# EAGLE design main_unit (EAGLE 7.1.0)
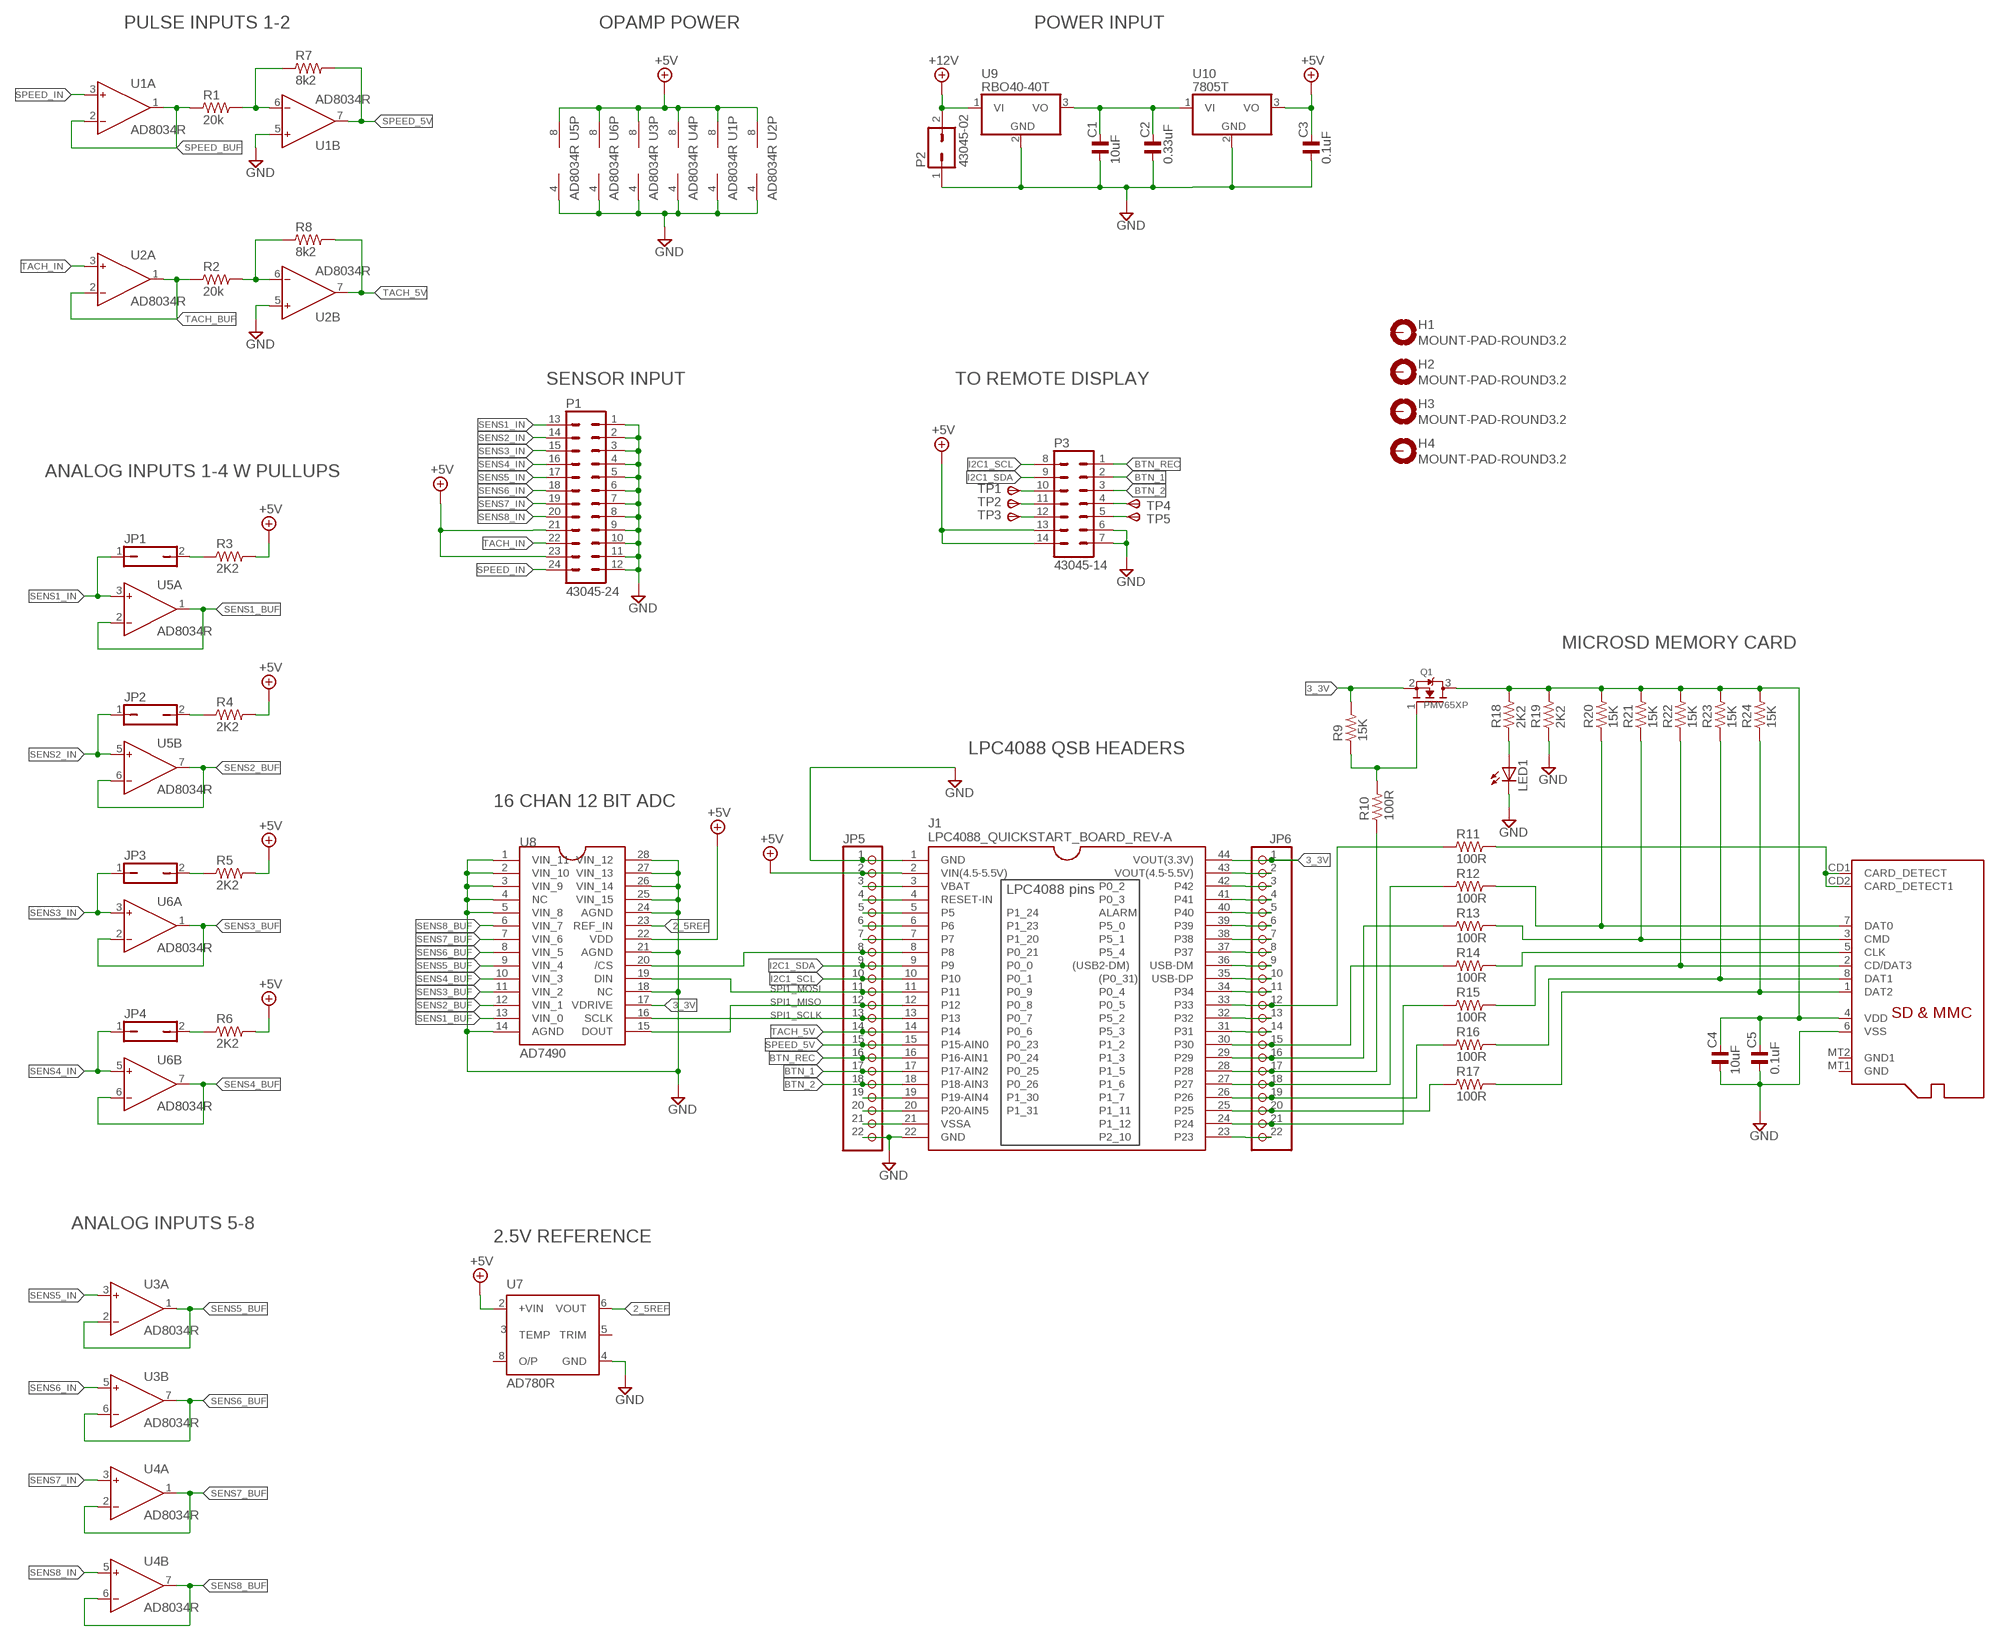
[diagram p0: schematic, sheet 1]

## Parts
C1  10uF  C_0805  [C0805]
C2  0.33uF  C_0805  [C0805]
C3  0.1uF  C_0805  [C0805]
C4  10uF  C_0805  [C0805]
C5  0.1uF  C_0805  [C0805]
H1  MOUNT-PAD-ROUND3.2  [3,2-PAD]
H2  MOUNT-PAD-ROUND3.2  [3,2-PAD]
H3  MOUNT-PAD-ROUND3.2  [3,2-PAD]
H4  MOUNT-PAD-ROUND3.2  [3,2-PAD]
J1  LPC4088_QUICKSTART_BOARD_REV-A  [LPC4088_QUICKSTART_BOARD_REV-A]
JP1  JP1Q  [JP1]
JP2  JP1Q  [JP1]
JP3  JP1Q  [JP1]
JP4  JP1Q  [JP1]
JP5  PINHD-1X22  [1X22]
JP6  PINHD-1X22  [1X22]
LED1  LEDCHIP-LED0805  [CHIP-LED0805]
P1  43045-24  [43045-24]
P2  43045-02  [43045-02]
P3  43045-14  [43045-14]
Q1  PMV65XP  MOSFET-NREFLOW  [SOT23]
R1  20k  R_0805  [R0805]
R2  20k  R_0805  [R0805]
R3  2K2  R_0805  [R0805]
R4  2K2  R_0805  [R0805]
R5  2K2  R_0805  [R0805]
R6  2K2  R_0805  [R0805]
R7  8k2  R_0805  [R0805]
R8  8k2  R_0805  [R0805]
R9  15K  R_0805  [R0805]
R10  100R  R_0805  [R0805]
R11  100R  R_0805  [R0805]
R12  100R  R_0805  [R0805]
R13  100R  R_0805  [R0805]
R14  100R  R_0805  [R0805]
R15  100R  R_0805  [R0805]
R16  100R  R_0805  [R0805]
R17  100R  R_0805  [R0805]
R18  2K2  R_0805  [R0805]
R19  2K2  R_0805  [R0805]
R20  15K  R_0805  [R0805]
R21  15K  R_0805  [R0805]
R22  15K  R_0805  [R0805]
R23  15K  R_0805  [R0805]
R24  15K  R_0805  [R0805]
SD1  MICROSD_SDMODE  [MICROSD]
TP1  TPSPAD1-13  [P1-13]
TP2  TPSPAD1-13  [P1-13]
TP3  TPSPAD1-13  [P1-13]
TP4  TPSPAD1-13  [P1-13]
TP5  TPSPAD1-13  [P1-13]
U1  AD8034R  [SO8]
U2  AD8034R  [SO8]
U3  AD8034R  [SO8]
U4  AD8034R  [SO8]
U5  AD8034R  [SO8]
U6  AD8034R  [SO8]
U7  AD780R  [SO8]
U8  AD7490  [TSSOP28]
U9  RBO40-40T  [TO220H]
U10  7805T  [TO220H]

## Nets
2_5REF: U7.6(VOUT) U8.23(REF_IN)
3_3V: J1.44(VOUT(3.3V)) JP6.1 Q1.2(S) R9.2 U8.17(VDRIVE)
+5V: C3.2 J1.2(VIN(4.5-5.5V)) JP5.2 P1.21 P1.23 P3.13 P3.14 R3.2 R4.2 R5.2 R6.2 U1.8(P:V+) U2.8(P:V+) U3.8(P:V+) U4.8(P:V+) U5.8(P:V+) U6.8(P:V+) U7.2(+VIN) U8.22(VDD) U10.3(VO)
+12V: P2.2 U9.1(VI)
BTN_1: J1.17(P17-AIN2) JP5.17 P3.2
BTN_2: J1.18(P18-AIN3) JP5.18 P3.3
BTN_REC: J1.16(P16-AIN1) JP5.16 P3.1
GND: C1.1 C2.1 C3.1 C4.1 C5.1 J1.1(GND) J1.22(GND) JP5.1 JP5.22 LED1.C P1.1 P1.2 P1.3 P1.4 P1.5 P1.6 P1.7 P1.8 P1.9 P1.10 P1.11 P1.12 P2.1 P3.6 P3.7 R19.1 SD1.6(VSS) U1.4(P:V-) U1.5(B:IN+) U2.4(P:V-) U2.5(B:IN+) U3.4(P:V-) U4.4(P:V-) U5.4(P:V-) U6.4(P:V-) U7.4(GND) U8.1(VIN_11) U8.2(VIN_10) U8.3(VIN_9) U8.4(NC) U8.5(VIN_8) U8.14(AGND) U8.18(NC) U8.21(AGND) U8.24(AGND) U8.25(VIN_15) U8.26(VIN_14) U8.27(VIN_13) U8.28(VIN_12) U9.2(GND) U10.2(GND)
I2C1_SCL: J1.10 JP5.10 P3.8
I2C1_SDA: J1.9 JP5.9 P3.9
N$1: R1.2 R7.1 U1.6(B:IN-)
N$2: R12.2 R20.1 SD1.7(DAT0)
N$3: R2.2 R8.1 U2.6(B:IN-)
N$4: R13.2 R21.1 SD1.3(CMD)
N$5: R14.2 SD1.5(CLK)
N$6: J1.8 JP5.8 U8.20(/CS)
N$7: R15.2 R22.1 SD1.2(CD/DAT3)
N$8: R16.2 R23.1 SD1.8(DAT1)
N$9: R17.2 R24.1 SD1.1(DAT2)
N$10: JP1.2 R3.1
N$11: J1.27 JP6.18 R12.1
N$12: J1.29 JP6.16 R13.1
N$13: J1.30 JP6.15 R14.1
N$14: J1.26 JP6.19 R16.1
N$15: J1.25 JP6.20 R17.1
N$16: J1.24 JP6.21 R15.1
N$17: J1.28 JP6.17 R10.1
N$18: Q1.1(G) R9.1 R10.2
N$19: LED1.A R18.1
N$20: R11.2 SD1.CD1(CARD_DETECT) SD1.CD2(CARD_DETECT1)
N$22: JP3.2 R5.1
N$23: J1.38 JP6.7
N$24: P3.10 TP1.TP(PP)
N$25: P3.11 TP2.TP(PP)
N$26: JP2.2 R4.1
N$27: C1.2 C2.2 U9.3(VO) U10.1(VI)
N$28: P3.12 TP3.TP(PP)
N$30: J1.3(VBAT) JP5.3
N$31: JP4.2 R6.1
N$32: J1.4(RESET-IN) JP5.4
N$33: P3.4 TP4.TP(PP)
N$34: J1.5 JP5.5
N$35: J1.6 JP5.6
N$36: P3.5 TP5.TP(PP)
N$37: J1.7 JP5.7
N$38: J1.19(P19-AIN4) JP5.19
N$39: J1.20(P20-AIN5) JP5.20
N$40: J1.21(VSSA) JP5.21
N$41: J1.43(VOUT(4.5-5.5V)) JP6.2
N$42: J1.42 JP6.3
N$43: J1.41 JP6.4
N$44: J1.40 JP6.5
N$45: J1.39 JP6.6
N$46: J1.37 JP6.8
N$47: J1.36(USB-DM) JP6.9
N$48: J1.35(USB-DP) JP6.10
N$49: J1.34 JP6.11
N$50: J1.33 JP6.12 R11.1
N$51: J1.32 JP6.13
N$52: J1.31 JP6.14
N$53: J1.23 JP6.22
SENS1_BUF: U5.1(A:OUT) U5.2(A:IN-) U8.13(VIN_0)
SENS1_IN: JP1.1 P1.13 U5.3(A:IN+)
SENS2_BUF: U5.6(B:IN-) U5.7(B:OUT) U8.12(VIN_1)
SENS2_IN: JP2.1 P1.14 U5.5(B:IN+)
SENS3_BUF: U6.1(A:OUT) U6.2(A:IN-) U8.11(VIN_2)
SENS3_IN: JP3.1 P1.15 U6.3(A:IN+)
SENS4_BUF: U6.6(B:IN-) U6.7(B:OUT) U8.10(VIN_3)
SENS4_IN: JP4.1 P1.16 U6.5(B:IN+)
SENS5_BUF: U3.1(A:OUT) U3.2(A:IN-) U8.9(VIN_4)
SENS5_IN: P1.17 U3.3(A:IN+)
SENS6_BUF: U3.6(B:IN-) U3.7(B:OUT) U8.8(VIN_5)
SENS6_IN: P1.18 U3.5(B:IN+)
SENS7_BUF: U4.1(A:OUT) U4.2(A:IN-) U8.7(VIN_6)
SENS7_IN: P1.19 U4.3(A:IN+)
SENS8_BUF: U4.6(B:IN-) U4.7(B:OUT) U8.6(VIN_7)
SENS8_IN: P1.20 U4.5(B:IN+)
SPEED_5V: J1.15(P15-AIN0) JP5.15 R7.2 U1.7(B:OUT)
SPEED_BUF: R1.1 U1.1(A:OUT) U1.2(A:IN-)
SPEED_IN: P1.24 U1.3(A:IN+)
SPI1_MISO: J1.12 JP5.12 U8.15(DOUT)
SPI1_MOSI: J1.11 JP5.11 U8.19(DIN)
SPI1_SCLK: J1.13 JP5.13 U8.16(SCLK)
TACH_5V: J1.14 JP5.14 R8.2 U2.7(B:OUT)
TACH_BUF: R2.1 U2.1(A:OUT) U2.2(A:IN-)
TACH_IN: P1.22 U2.3(A:IN+)
VDD: C4.2 C5.2 Q1.3(D) R18.2 R19.2 R20.2 R21.2 R22.2 R23.2 R24.2 SD1.4(VDD)
Unconnected: H1.B3,2(MOUNT) H2.B3,2(MOUNT) H3.B3,2(MOUNT) H4.B3,2(MOUNT) SD1.MT1(GND) SD1.MT2(GND1) U7.3(TEMP) U7.5(TRIM) U7.8(O/P)

## Notes on the sheet
- PULSE INPUTS 1-2 | OPAMP POWER | POWER INPUT
- SENSOR INPUT | TO REMOTE DISPLAY
- ANALOG INPUTS 1-4 W PULLUPS
- MICROSD MEMORY CARD
- LPC4088 QSB HEADERS
- 16 CHAN 12 BIT ADC
- ANALOG INPUTS 5-8
- 2.5V REFERENCE

## Library data of the parts
C1-C5 = rc-master-smd:C_: NON-POLARIZED CAP
H1-H4 = holes:MOUNT-PAD-ROUND: MOUNTING PAD, round
J1 = lpc4088_quickstart_board:LPC4088_QUICKSTART_BOARD_REV-A
JP1-JP4 = jumper:JP1Q: JUMPER
JP5 JP6 = pinhead:PINHD-1X22: PIN HEADER
LED1 = adafruit:LED: LED OSRAM: - CHIPLED LG R971, LG N971, LY N971, LG Q971, LY Q971, LO R971, LY R971 LH N974, LH R974 LS Q976, LO Q976, LY Q976 LO Q996 - Hyper CHIPLED LW Q18S LB Q993, LB Q99A, LB R99A - SideLED LS A670, LO A670, LY A670, LG A670, LP A670 LB A673, LV A673, LT A673, LW A673 LH A674 LY A675 LS A676, LA A676, LO A676, LY A676, LW A676 LS A679, LY A679, LG A679 - Hyper Micro SIDELED® LS Y876, LA Y876, LO Y876, LY Y876 LT Y87S - SmartLED LW L88C, LW L88S LB L89C, LB L89S, LG L890 LS L89K, LO L89K, LY L89K LS L896, LA L896, LO L896, LY L896 - TOPLED LS T670, LO T670, LY T670, LG T670, LP T670 LSG T670, LSP T670, LSY T670, LOP T670, LYG T670 LG T671, LOG T671, LSG T671 LB T673, LV T673, LT T673, LW T673 LH T674 LS T676, LA T676, LO T676, LY T676, LB T676, LH T676, LSB T676, LW T676 LB T67C, LV T67C, LT T67C, LS T67K, LO T67K, LY T67K, LW E67C LS E67B, LA E67B, LO E67B, LY E67B, LB E67C, LV E67C, LT E67C LW T67C LS T679, LY T679, LG T679 LS T770, LO T770, LY T770, LG T770, LP T770 LB T773, LV T773, LT T773, LW T773 LH T774 LS E675, LA E675, LY E675, LS T675 LS T776, LA T776, LO T776, LY T776, LB T776 LHGB T686 LT T68C, LB T68C - Hyper Mini TOPLED® LB M676 - Mini TOPLED Santana® LG M470 LS M47K, LO M47K, LY M47K Source: http://www.osram.convergy.de/
P1 = con-molex-micro-fit:43045-24: HEADER
P2 = con-molex-micro-fit:43045-02: HEADER
P3 = con-molex-micro-fit:43045-14: HEADER
Q1 = adafruit:MOSFET-N: N-Channel Mosfet 2N7002E - 60V 260mA SOT23 [Digikey: 2N7002ET1GOSTR-ND] - REEL BSH103 - 30V 850mA SOT23 [Digikey: 568-5013-1-ND]
R1-R24 = rc-master-smd:R_: RESISTOR
SD1 = adafruit:MICROSD_SDMODE: modified for SDMODE by Dan D.
TP1-TP5 = testpad:TPS: TEST PIN; OC_NEWARK: unknown
U1-U6 = analog-devices:AD8034: 2.7 V, 800 ?A, 80 MHz Rail-to-Rail I/O Amplifiers Source: http://www.analog.com/static/imported-files/data_sheets/AD8031_8032.pdf; MF: ALTERA CORPORATION; MPN: AD8033ARZ; OC_FARNELL: 8621519; OC_NEWARK: 59K6245
U7 = analog-devices:AD780: High Precision Reference 2.5V/3.0V Source: http://www.analog.com/UploadedFiles/Data_Sheets/AD780.pdf; MPN: AD780BRZ-REEL; OC_FARNELL: 1464655; OC_NEWARK: 12M8938
U8 = analog-devices:AD7490: AD7490 by Dan D.
U9 = dan:RBO40-40T
U10 = adafruit:78*: Positive VOLTAGE REGULATOR Added bigger pads to the TO-92 package

## Board
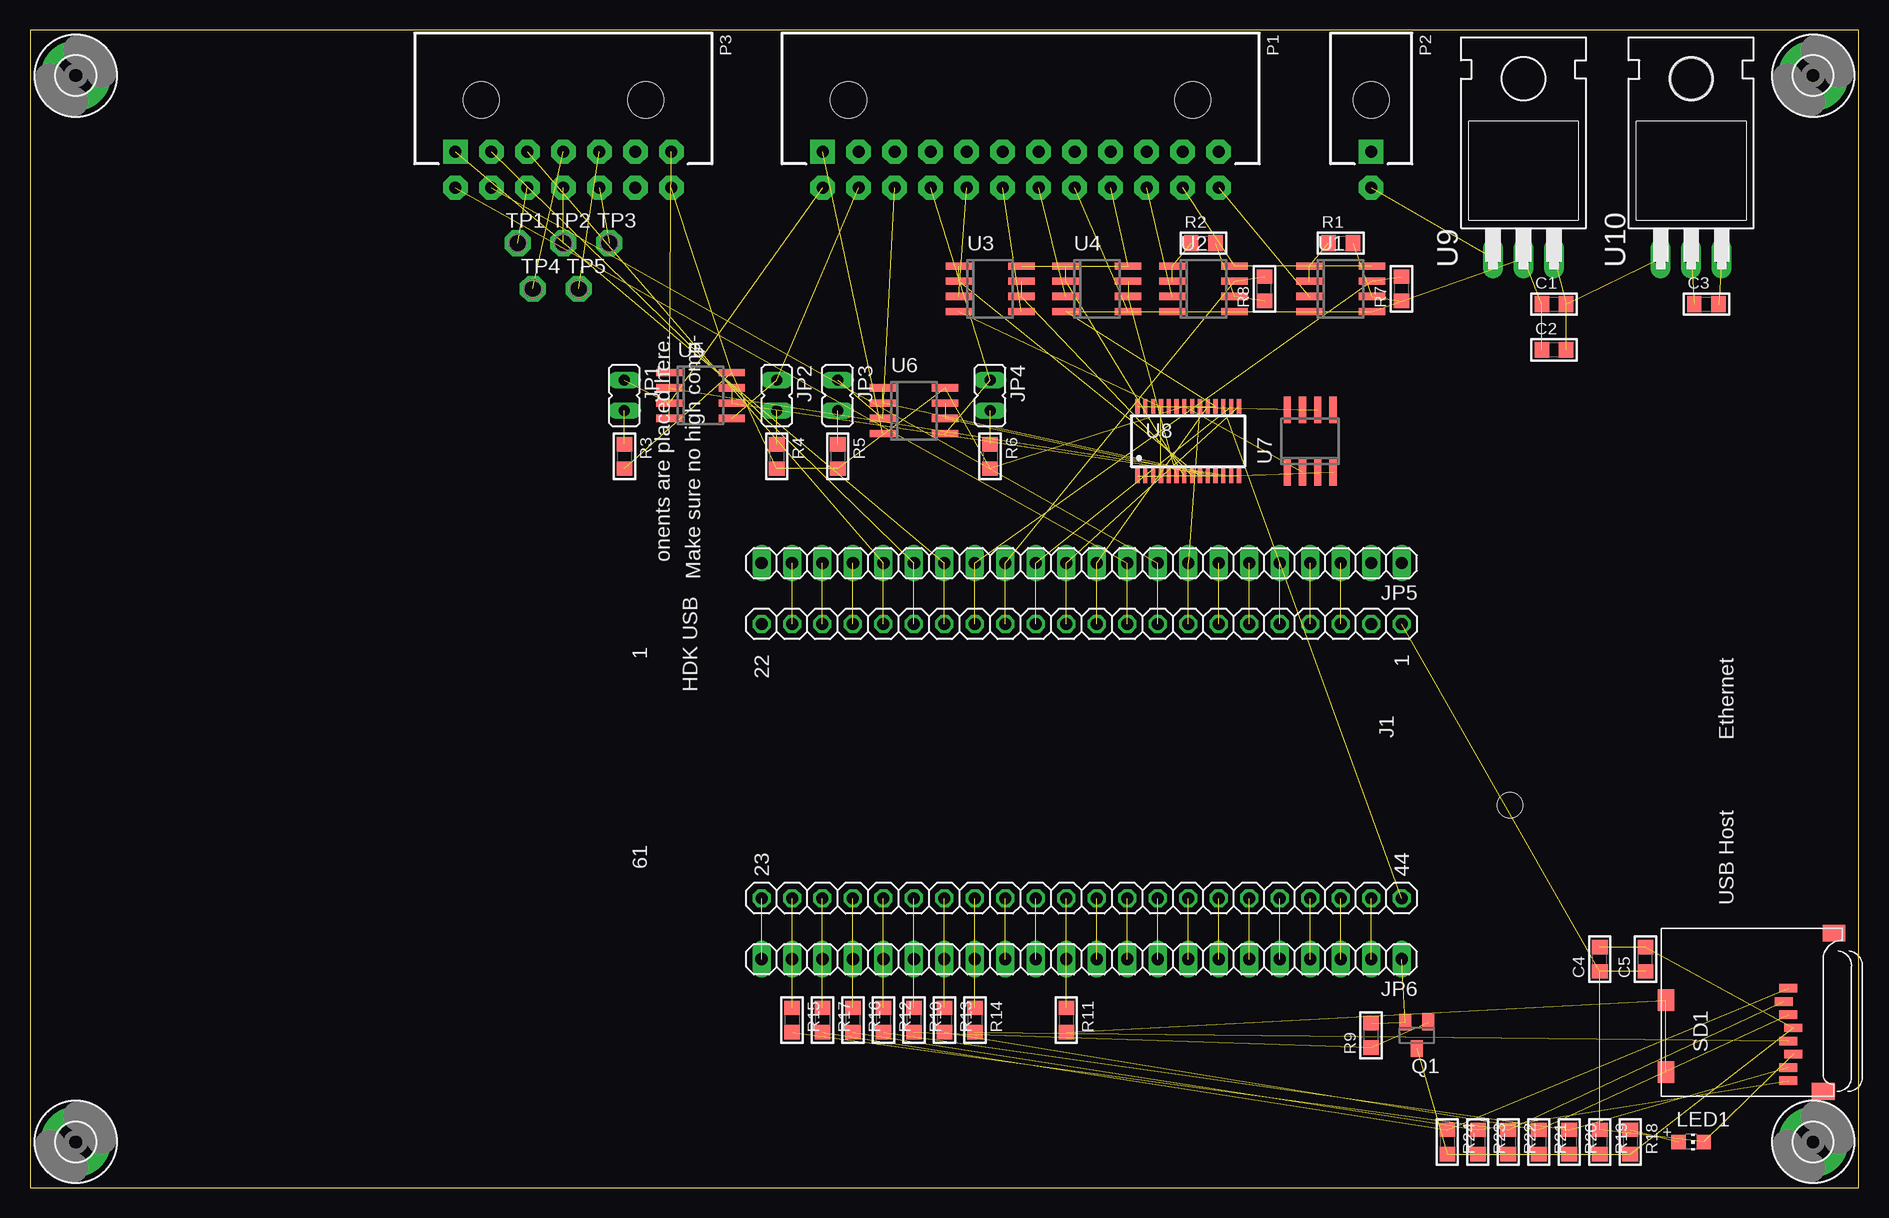
[diagram p1: board, top side]
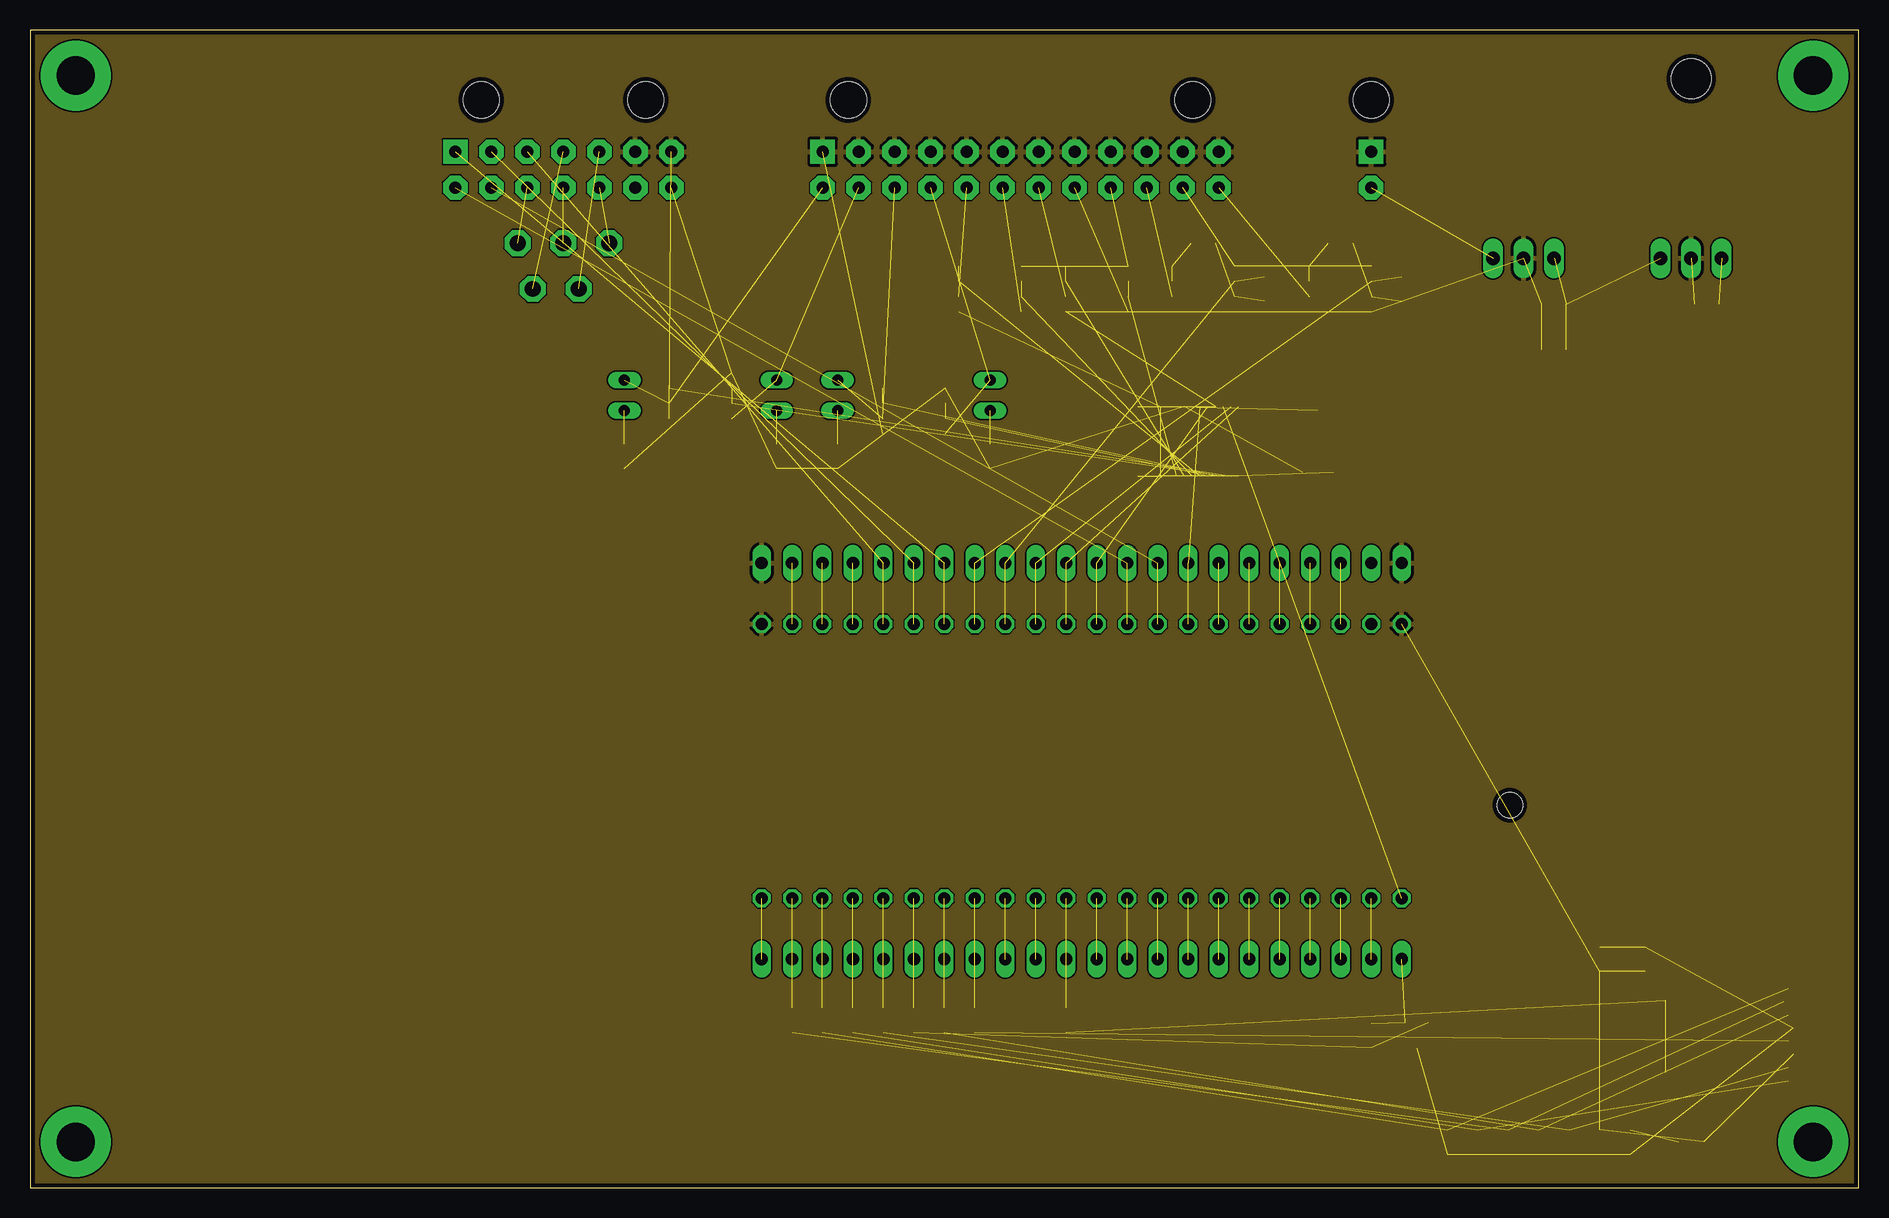
[diagram p2: board, inner layer GroundPlane]
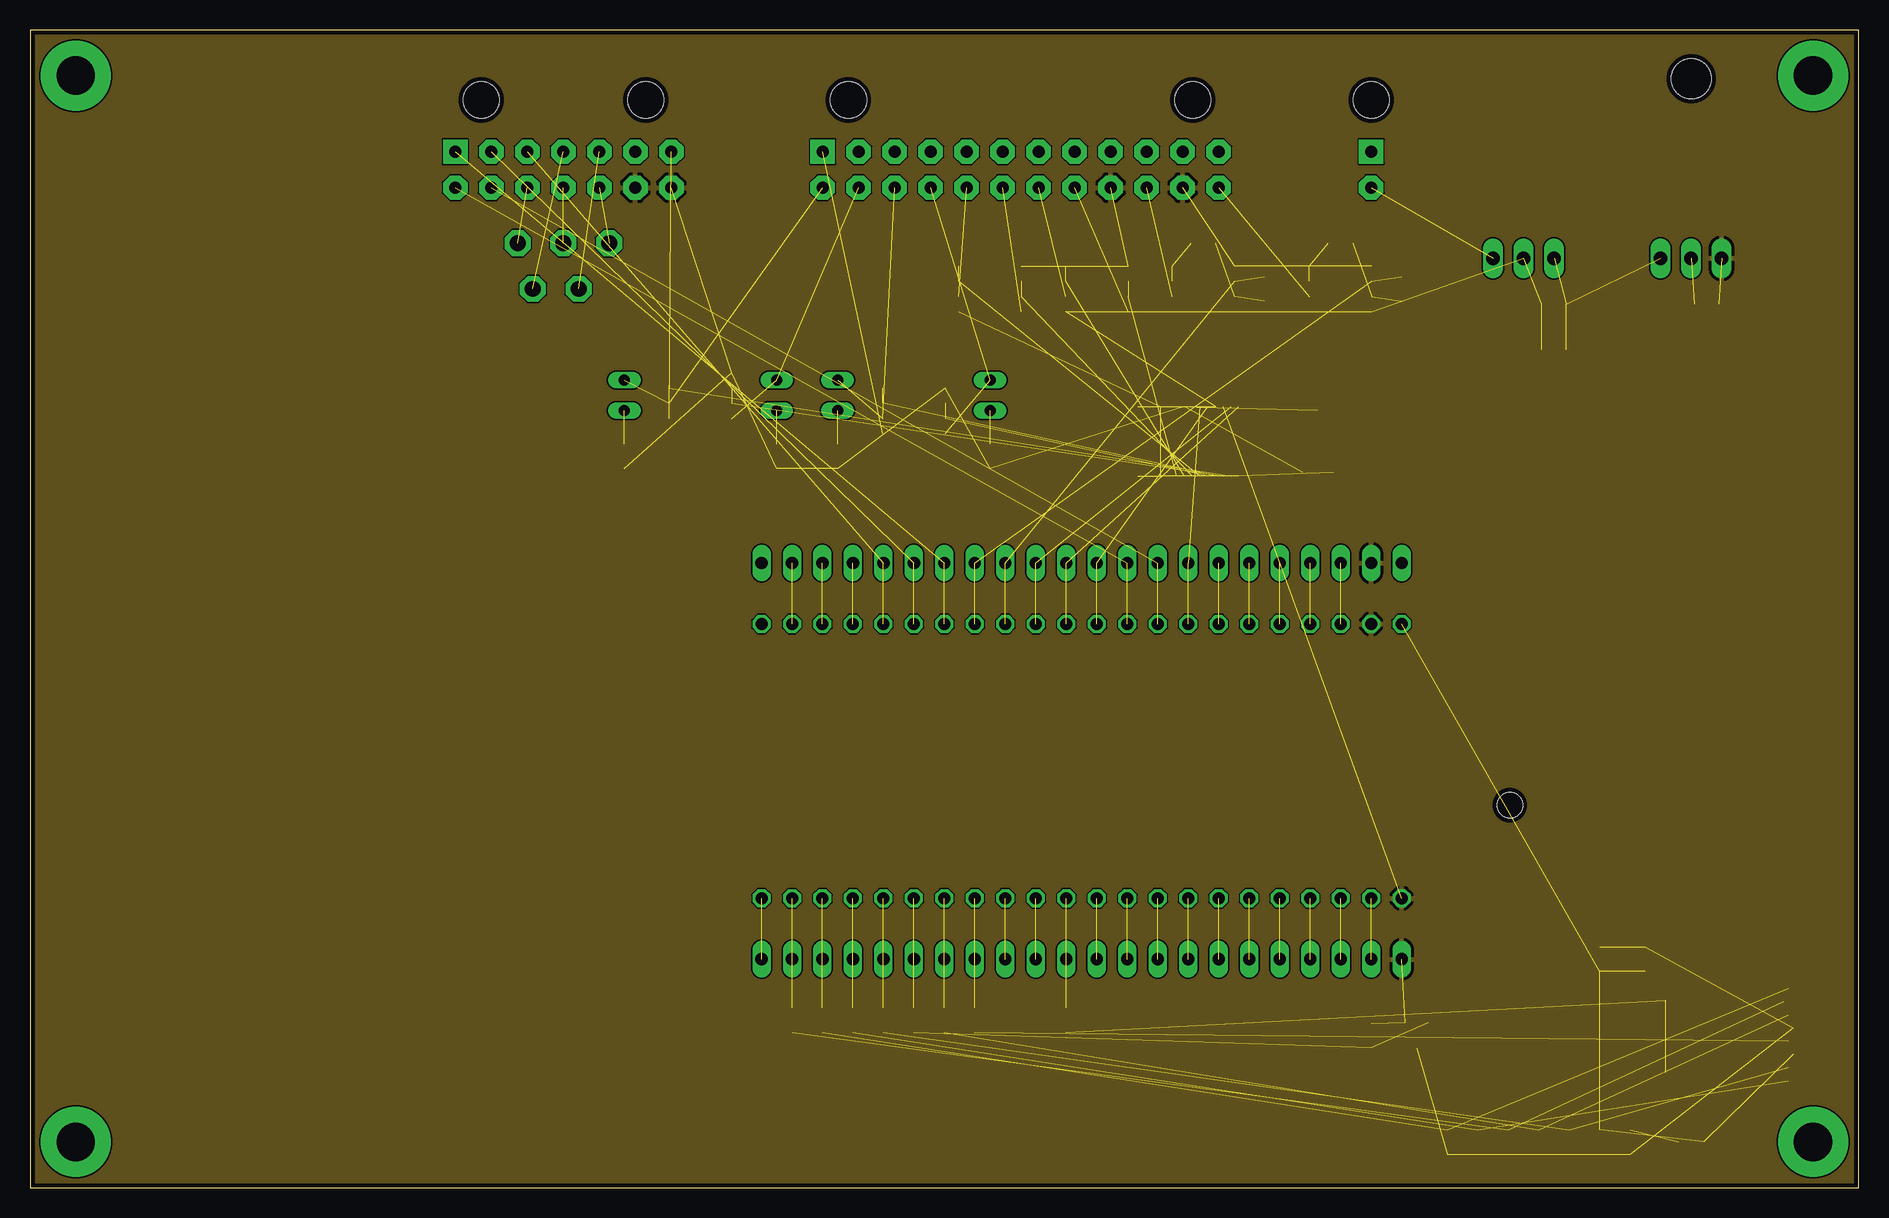
[diagram p3: board, inner layer PowerPlane]

Size 152.4 x 96.51 mm. Coordinates in mm from the lower left corner, seen from the top.
Outline: 0,0 152.4,0 152.4,96.51 0,96.51 0,0
Copper layers (1*2*15*16): Top 0.035559375mm / dielectric 0.17018125mm / GroundPlane 0.01778125mm / dielectric 47mil / PowerPlane 0.01778125mm / dielectric 0.17018125mm / Bottom 0.035559375mm
Design rules "OSHPark-4layer *": minimum track width 7mil, minimum drill 10mil, track to track 5mil, track to pad 5mil, pad to pad 5mil, via to via 5mil, smd to smd 5mil, copper to edge 15mil, drill to drill 6mil, minimum pad ring 4mil, minimum via ring 4mil, stop-mask expansion 4mil, vias tented up to drill 0mil, thermal gap 10mil

### Footprints (pad centres in the part's own frame; a part is rotated, then mirrored left to right if it is on the bottom)
C0805 = smd 1.2 x 1.3: 1 -1.016,0; 2 1.016,0
3,2-PAD = drill 3.2 pad 5.842: B3,2 0,0
LPC4088_QUICKSTART_BOARD_REV-A = drill 1 octagon: 1 -11.43,24.13; 2 -11.43,21.59; 3 -11.43,19.05; 4 -11.43,16.51; 5 -11.43,13.97; 6 -11.43,11.43; 7 -11.43,8.89; 8 -11.43,6.35; 9 -11.43,3.81; 10 -11.43,1.27; 11 -11.43,-1.27; 12 -11.43,-3.81; 13 -11.43,-6.35; 14 -11.43,-8.89; 15 -11.43,-11.43; 16 -11.43,-13.97; 17 -11.43,-16.51; 18 -11.43,-19.05; 19 -11.43,-21.59; 20 -11.43,-24.13; 21 -11.43,-26.67; 22 -11.43,-29.21; 23 11.43,-29.21; 24 11.43,-26.67; 25 11.43,-24.13; 26 11.43,-21.59; 27 11.43,-19.05; 28 11.43,-16.51; 29 11.43,-13.97; 30 11.43,-11.43; 31 11.43,-8.89; 32 11.43,-6.35; 33 11.43,-3.81; 34 11.43,-1.27; 35 11.43,1.27; 36 11.43,3.81; 37 11.43,6.35; 38 11.43,8.89; 39 11.43,11.43; 40 11.43,13.97; 41 11.43,16.51; 42 11.43,19.05; 43 11.43,21.59; 44 11.43,24.13 | hole 2.1: 3.683,33.147
JP1 = drill 0.914 long: 1 0,-1.27; 2 0,1.27
1X22 = drill 1.016 long: 1 -26.67,0; 2 -24.13,0; 3 -21.59,0; 4 -19.05,0; 5 -16.51,0; 6 -13.97,0; 7 -11.43,0; 8 -8.89,0; 9 -6.35,0; 10 -3.81,0; 11 -1.27,0; 12 1.27,0; 13 3.81,0; 14 6.35,0; 15 8.89,0; 16 11.43,0; 17 13.97,0; 18 16.51,0; 19 19.05,0; 20 21.59,0; 21 24.13,0; 22 26.67,0
CHIP-LED0805 = smd 1.2 x 1.2: A 0,-1.05; C 0,1.05
43045-24 = drill 1.016 pad 2.032 square: 1 16.5,0 | drill 1.016 pad 2.032 octagon: 2 13.5,0; 3 10.5,0; 4 7.5,0; 5 4.5,0; 6 1.5,0; 7 -1.5,0; 8 -4.5,0; 9 -7.5,0; 10 -10.5,0; 11 -13.5,0; 12 -16.5,0; 13 16.5,3; 14 13.5,3; 15 10.5,3; 16 7.5,3; 17 4.5,3; 18 1.5,3; 19 -1.5,3; 20 -4.5,3; 21 -7.5,3; 22 -10.5,3; 23 -13.5,3; 24 -16.5,3 | hole 3: -14.35,-4.32; 14.35,-4.32
43045-02 = drill 1.016 pad 2.032 square: 1 0,0 | drill 1.016 pad 2.032 octagon: 2 0,3 | hole 3: 0,-4.32
43045-14 = drill 1.016 pad 2.032 square: 1 9,0 | drill 1.016 pad 2.032 octagon: 2 6,0; 3 3,0; 4 0,0; 5 -3,0; 6 -6,0; 7 -9,0; 8 9,3; 9 6,3; 10 3,3; 11 0,3; 12 -3,3; 13 -6,3; 14 -9,3 | hole 3: -6.85,-4.32; 6.85,-4.32
SOT23 = smd 1 x 1.4: 1 -0.95,-1.1; 2 0.95,-1.1; 3 0,1.1
R0805 = smd 1.2 x 1.3: 1 -1.016,0; 2 1.016,0
MICROSD = smd 0.7 x 1.5: 1 9,-10.64; 2 7.9,-10.24; 3 6.8,-10.64; 4 5.7,-11.04; 5 4.6,-10.64; 6 3.5,-11.04; 7 2.4,-10.64; 8 1.3,-10.64 | smd 1.8 x 1.4: CD1 2,-0.44; CD2 8,-0.44 | smd 1.4 x 1.9: MT1 0.4,-13.54; MT2 13.6,-14.44
P1-13 = drill 1.321 pad 2.159 octagon: TP 0,0
SO8 = smd 0.6 x 2.2: 1 -1.905,-2.6; 2 -0.635,-2.6; 3 0.635,-2.6; 4 1.905,-2.6; 5 1.905,2.6; 6 0.635,2.6; 7 -0.635,2.6; 8 -1.905,2.6
TSSOP28 = smd 0.35 x 1.2: 1 -4.225,-2.9; 2 -3.575,-2.9; 3 -2.925,-2.9; 4 -2.275,-2.9; 5 -1.625,-2.9; 6 -0.975,-2.9; 7 -0.325,-2.9; 8 0.325,-2.9; 9 0.975,-2.9; 10 1.625,-2.9; 11 2.275,-2.9; 12 2.925,-2.9; 13 3.575,-2.9; 14 4.225,-2.9; 15 4.225,2.9; 16 3.575,2.9; 17 2.925,2.9; 18 2.275,2.9; 19 1.625,2.9; 20 0.975,2.9; 21 0.325,2.9; 22 -0.325,2.9; 23 -0.975,2.9; 24 -1.625,2.9; 25 -2.275,2.9; 26 -2.925,2.9; 27 -3.575,2.9; 28 -4.225,2.9
TO220H = drill 1.118 long: 1 -3.81,-7.62; 2 -1.27,-7.62; 3 1.27,-7.62
TO220H' = drill 1.118 long: 1 -2.54,-10.16; 2 0,-10.16; 3 2.54,-10.16 | hole 3.302: 0,4.826

### Placement (x,y rotation side)
C1  127,73.66 0 top
C2  127,69.85 0 top
C3  139.7,73.66 0 top
C4  130.81,19.05 90 top
C5  134.62,19.05 90 top
H1  3.81,92.71 0 top
H2  148.59,92.71 0 top
H3  148.59,3.81 0 top
H4  3.81,3.81 0 top
J1  90.17,35.56 270 top
JP1  49.53,66.04 180 top
JP2  62.23,66.04 180 top
JP3  67.31,66.04 180 top
JP4  80.01,66.04 180 top
JP5  87.63,52.07 180 top
JP6  87.63,19.05 180 top
LED1  138.43,3.81 270 top
P1  82.55,86.36 180 top
P2  111.76,86.36 180 top
P3  44.45,86.36 180 top
Q1  115.57,12.7 180 top
R1  109.22,78.74 0 top
R2  97.79,78.74 0 top
R3  49.53,60.96 270 top
R4  62.23,60.96 270 top
R5  67.31,60.96 270 top
R6  80.01,60.96 270 top
R7  114.3,74.93 90 top
R8  102.87,74.93 90 top
R9  111.76,12.7 90 top
R10  73.66,13.97 270 top
R11  86.36,13.97 270 top
R12  71.12,13.97 270 top
R13  76.2,13.97 270 top
R14  78.74,13.97 270 top
R15  63.5,13.97 270 top
R16  68.58,13.97 270 top
R17  66.04,13.97 270 top
R18  133.35,3.81 270 top
R19  130.81,3.81 270 top
R20  128.27,3.81 270 top
R21  125.73,3.81 270 top
R22  123.19,3.81 270 top
R23  120.65,3.81 270 top
R24  118.11,3.81 270 top
SD1  135.89,7.62 90 top
TP1  40.64,78.74 0 top
TP2  44.45,78.74 0 top
TP3  48.26,78.74 0 top
TP4  41.91,74.93 0 top
TP5  45.72,74.93 0 top
U1  109.22,74.93 270 top
U2  97.79,74.93 270 top
U3  80.01,74.93 270 top
U4  88.9,74.93 270 top
U5  55.88,66.04 270 top
U6  73.66,64.77 270 top
U7  106.68,62.23 0 top
U8  96.52,62.23 0 top
U9  125.73,85.09 0 top
U10  7805T  [TO220H']  138.43,87.63 0 top

### Tracks (layer width: path | path; a pad name or v marks a point on that pad's centre or on a via)
2_5REF  (1 unrouted)
3_3V  (3 unrouted)
  pour PowerPlane: 113.03,25.4 157.48,25.4 157.48,-1.27 113.03,-1.27
+5V  (13 unrouted)
  pour PowerPlane: -1.27,-1.27 113.03,-1.27 113.03,25.4 157.48,25.4 157.48,97.79 -1.27,97.79
+12V  (1 unrouted)
BTN_1  (2 unrouted)
BTN_2  (2 unrouted)
BTN_REC  (2 unrouted)
GND  (30 unrouted)
  pour GroundPlane: -1.27,97.79 153.67,97.79 153.67,-1.27 -1.27,-1.27
I2C1_SCL  (2 unrouted)
I2C1_SDA  (2 unrouted)
N$1  (2 unrouted)
N$2  (2 unrouted)
N$3  (2 unrouted)
N$4  (2 unrouted)
N$5  (1 unrouted)
N$6  (2 unrouted)
N$7  (2 unrouted)
N$8  (2 unrouted)
N$9  (2 unrouted)
N$10  (1 unrouted)
N$11  (2 unrouted)
N$12  (2 unrouted)
N$13  (2 unrouted)
N$14  (2 unrouted)
N$15  (2 unrouted)
N$16  (2 unrouted)
N$17  (2 unrouted)
N$18  (2 unrouted)
N$19  (1 unrouted)
N$20  (2 unrouted)
N$22  (1 unrouted)
N$23  (1 unrouted)
N$24  (1 unrouted)
N$25  (1 unrouted)
N$26  (1 unrouted)
N$27  (3 unrouted)
N$28  (1 unrouted)
N$30  (1 unrouted)
N$31  (1 unrouted)
N$32  (1 unrouted)
N$33  (1 unrouted)
N$34  (1 unrouted)
N$35  (1 unrouted)
N$36  (1 unrouted)
N$37  (1 unrouted)
N$38  (1 unrouted)
N$39  (1 unrouted)
N$40  (1 unrouted)
N$41  (1 unrouted)
N$42  (1 unrouted)
N$43  (1 unrouted)
N$44  (1 unrouted)
N$45  (1 unrouted)
N$46  (1 unrouted)
N$47  (1 unrouted)
N$48  (1 unrouted)
N$49  (1 unrouted)
N$50  (2 unrouted)
N$51  (1 unrouted)
N$52  (1 unrouted)
N$53  (1 unrouted)
SENS1_BUF  (2 unrouted)
SENS1_IN  (2 unrouted)
SENS2_BUF  (2 unrouted)
SENS2_IN  (2 unrouted)
SENS3_BUF  (2 unrouted)
SENS3_IN  (2 unrouted)
SENS4_BUF  (2 unrouted)
SENS4_IN  (2 unrouted)
SENS5_BUF  (2 unrouted)
SENS5_IN  (1 unrouted)
SENS6_BUF  (2 unrouted)
SENS6_IN  (1 unrouted)
SENS7_BUF  (2 unrouted)
SENS7_IN  (1 unrouted)
SENS8_BUF  (2 unrouted)
SENS8_IN  (1 unrouted)
SPEED_5V  (3 unrouted)
SPEED_BUF  (2 unrouted)
SPEED_IN  (1 unrouted)
SPI1_MISO  (2 unrouted)
SPI1_MOSI  (2 unrouted)
SPI1_SCLK  (2 unrouted)
TACH_5V  (3 unrouted)
TACH_BUF  (2 unrouted)
TACH_IN  (1 unrouted)
VDD  (10 unrouted)